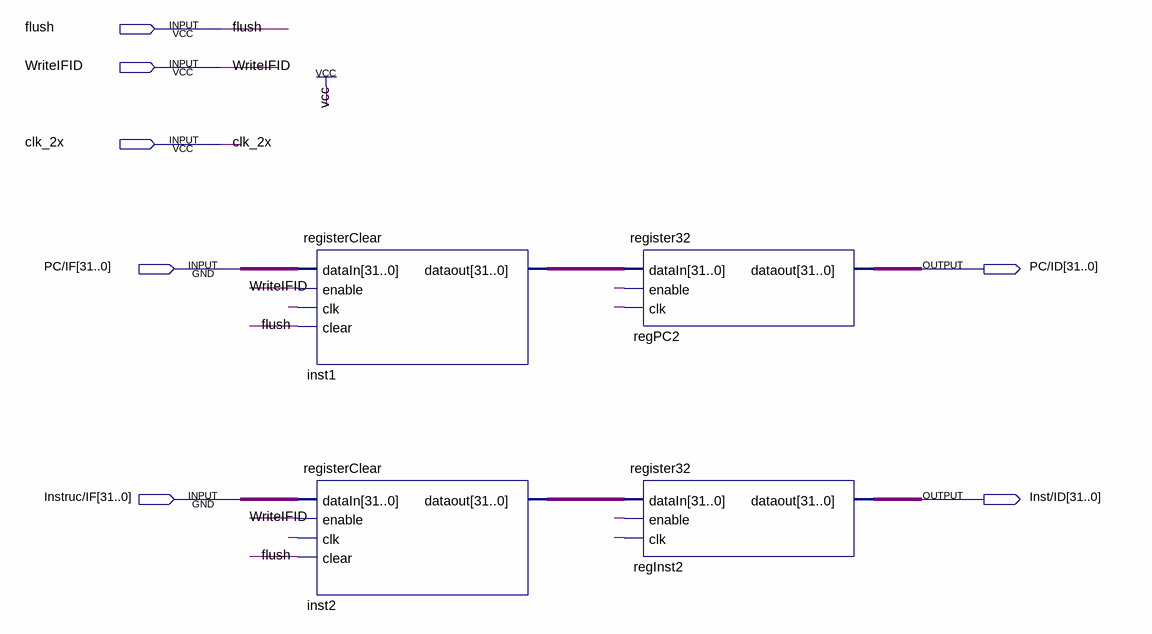
[diagram p0: schematic sheet]
// Quartus schematic registerIFID.bdf as structural Verilog: 4 symbols, 7 pins
module registerIFID (
  input  flush,
  input  WriteIFID,
  input  clk_2x,
  input  [31:0] \PC/IF ,
  input  [31:0] \Instruc/IF ,
  output [31:0] \PC/ID ,
  output [31:0] \Inst/ID 
);

  wire [31:0] inst1_dataout, inst2_dataout;

  registerClear inst1 (.dataIn(\PC/IF ), .enable(WriteIFID), .clk(clk_2x), .clear(flush), .dataout(inst1_dataout));
  registerClear inst2 (.dataIn(\Instruc/IF ), .enable(WriteIFID), .clk(clk_2x), .clear(flush), .dataout(inst2_dataout));
  register32 regPC2 (.dataIn(inst1_dataout), .enable(1'b1), .clk(clk_2x), .dataout(\PC/ID ));
  register32 regInst2 (.dataIn(inst2_dataout), .enable(1'b1), .clk(clk_2x), .dataout(\Inst/ID ));
endmodule
